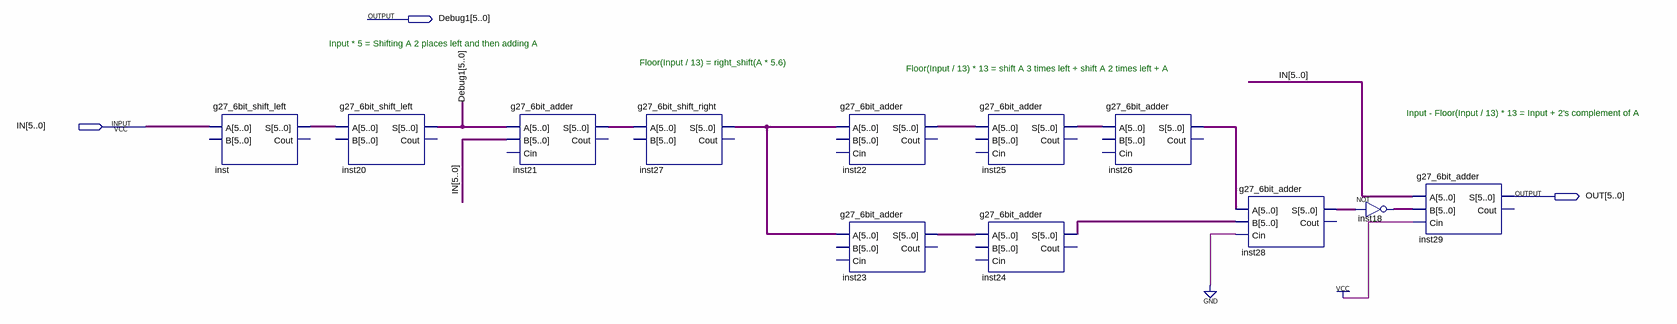
[diagram p0: schematic sheet]
// Quartus schematic g27_Modulo_13.bdf as structural Verilog: 12 symbols, 3 pins
module g27_Modulo_13 (
  input  [5:0] IN,
  output [5:0] Debug1,
  output [5:0] OUT
);

  wire [5:0] inst18_out, inst21_s, inst22_s, inst23_s, inst24_s, inst25_s, inst26_s, inst27_s, inst28_s,
       inst_s;

  g27_6bit_shift_left inst (.A(IN), .S(inst_s));  // open: B, Cout
  g27_6bit_shift_left inst20 (.A(inst_s), .S(Debug1));  // open: B, Cout
  g27_6bit_adder inst21 (.A(Debug1), .B(IN), .S(inst21_s));  // open: Cin, Cout
  g27_6bit_shift_right inst27 (.A(inst21_s), .S(inst27_s));  // open: B, Cout
  g27_6bit_adder inst22 (.A(inst27_s), .S(inst22_s));  // open: B, Cin, Cout
  g27_6bit_adder inst23 (.A(inst27_s), .S(inst23_s));  // open: B, Cin, Cout
  g27_6bit_adder inst25 (.A(inst22_s), .S(inst25_s));  // open: B, Cin, Cout
  g27_6bit_adder inst24 (.A(inst23_s), .S(inst24_s));  // open: B, Cin, Cout
  g27_6bit_adder inst26 (.A(inst25_s), .S(inst26_s));  // open: B, Cin, Cout
  g27_6bit_adder inst28 (.A(inst26_s), .B(inst24_s), .Cin(1'b0), .S(inst28_s));  // open: Cout
  assign inst18_out = ~inst28_s;  // NOT inst18, 6 bits wide
  g27_6bit_adder inst29 (.A(IN), .B(inst18_out), .Cin(1'b1), .S(OUT));  // open: Cout

  // Notes on the sheet:
  //   Input * 5 = Shifting A 2 places left and then adding A
  //   Floor(Input / 13) = right_shift(A * 5.6) 
  //   Floor(Input / 13) * 13 = shift A 3 times left + shift A 2 times left + A
  //   Input - Floor(Input / 13) * 13 = Input + 2's complement of A
endmodule
